# Altium schematic sheet Main.SchDoc
size A3; SheetNumber: 7; SheetTotal: 7
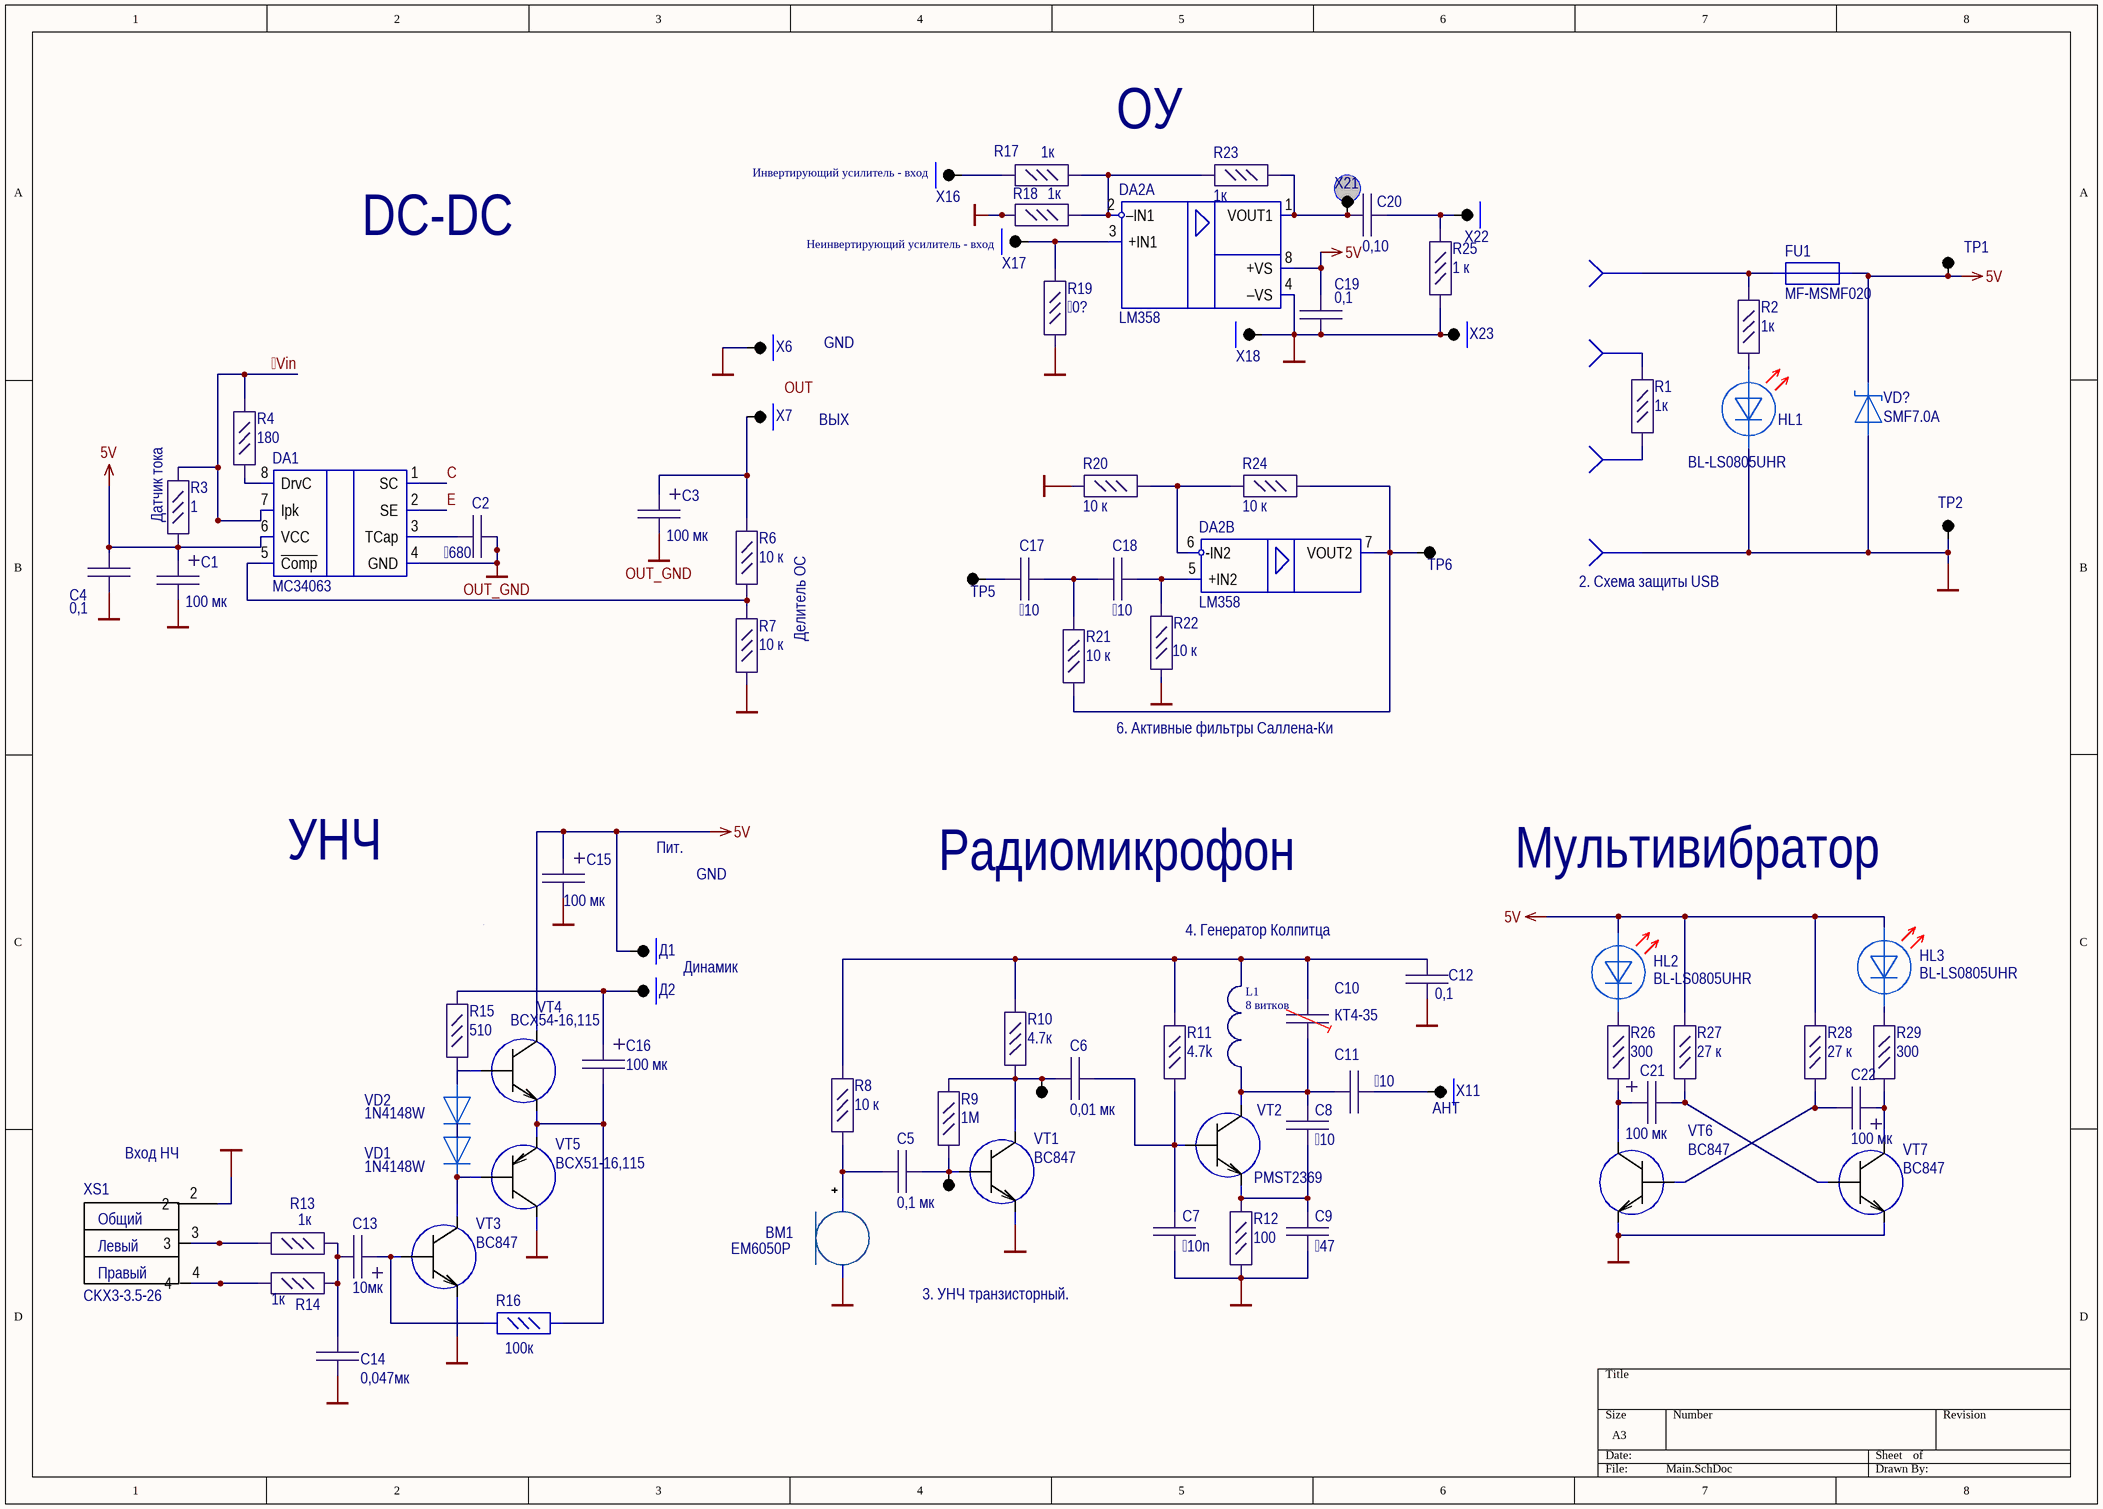
[diagram p0: Main.SchDoc]

## Parts
(Parts that share a designator on the sheet are numbered #1, #2 ... from top to bottom, then left to right.)
BM1  EM6050P  [EM6050P]
C1  100 мк  [SMD_al_cap_0605_6.3]
C2  680  [C_0805]
C3  100 мк  [SMD_al_cap_0605_6.3]
C4  0,1  [C_0805]
C5  0,1 мк  [C_0805]
C6  0,01 мк  [C_0805]
C7  10n  [C_0805]
C8  10  [C_0805]
C9  47  [C_0805]
C10  КТ4-35  [KТ4-35]
C11  10  [C_0805]
C12  0,1  [C_0805]
C13  10мк  [C_CASE]
C14  0,047мк  [C_0805]
C15  100 мк  [SMD_al_cap_0605_6.3]
C16  100 мк  [C_CASE]
C17  10  [C_0805]
C18  10  [C_0805]
C19  0,1  [C_0805]
C20  0,10  [C_0805]
C21  100 мк  [SMD_al_cap_0605_6.3]
C22  100 мк  [SMD_al_cap_0605_6.3]
DA1  MC34063  [SO-8]
DA2  LM358  [SO-8]  (parts A,B of 2)
FU1  MF-MSMF020  [FUSE 1812]
HL1  BL-LS0805UHR  [LED_0805_RED]
HL2  BL-LS0805UHR  [LED_0805_RED]
HL3  BL-LS0805UHR  [LED_0805_RED]
L1  8 витков  [Inductor]
R1  1к  [R_0805]
R2  1к  [R_0805]
R3  1  [R_0805]
R4  180  [R_0805]
R6  10 к  [R_0805]
R7  10 к  [R_0805]
R8  10 к  [R_0805]
R9  1М  [R_0805]
R10  4.7к  [R_0805]
R11  4.7k  [R_0805]
R12  100  [R_0805]
R13  1к  [R_0805]
R14  1к  [R_0805]
R15  510  [R_0805]
R16  100к  [R_0805]
R17  1к  [R_0805]
R18  1к  [R_0805]
R19  0?  [R_0805]
R20  10 к  [R_0805]
R21  10 к  [R_0805]
R22  10 к  [R_0805]
R23  1к  [R_0805]
R24  10 к  [R_0805]
R25  1 к  [R_0805]
R26  300  [R_0805]
R27  27 к  [R_0805]
R28  27 к  [R_0805]
R29  300  [R_0805]
TP1  Test_Point_1  [PLS-1]  (value not drawn)
TP2  Test_Point_1  [PLS-1]  (value not drawn)
TP5  Test_Point_1  [PLS-1]  (value not drawn)
TP6  Test_Point_1  [PLS-1]  (value not drawn)
TP?#1  Test_Point_1  [PLS-1]  (value not drawn)
TP?#2  Test_Point_1  [PLS-1]  (value not drawn)
VD1  1N4148W  [SOD-80]
VD2  1N4148W  [SOD-80]
VD?  SMF7.0A  [SOD-123F]
VT1  BC847  [SOT23]
VT2  PMST2369  [SOT-323]
VT3  BC847  [SOT23]
VT4  BCX54-16,115  [SOT89]
VT5  BCX51-16,115  [SOT89]
VT6  BC847  [SOT23]
VT7  BC847  [SOT23]
X6  КТ  [PLS-1]  (value not drawn)
X7  КТ  [PLS-1]  (value not drawn)
X11  КТ  [PLS-1]  (value not drawn)
X16  КТ  [PLS-1]  (value not drawn)
X17  КТ  [PLS-1]  (value not drawn)
X18  КТ  [PLS-1]  (value not drawn)
X21  КТ  [PLS-1]  (value not drawn)
X22  КТ  [PLS-1]  (value not drawn)
X23  КТ  [PLS-1]  (value not drawn)
X?#1  X  [KT_1]  (value not drawn)
X?#2  X  [KT_1]  (value not drawn)
X?#3  X  [KT_1]  (value not drawn)
X?#4  X  [KT_1]  (value not drawn)
XS1  CKX3-3.5-26  [CKX3-3.5-26]
Д1  КТ  [PLS-1]  (value not drawn)
Д2  КТ  [PLS-1]  (value not drawn)

## Nets
5V: C1.1 C4.1 C15.1 C19.1 DA1.6(VCC) DA2.8(+VS) FU1.2 HL2.1 HL3.1 R3.2 R27.1 R28.1 TP1.1 VD?.2 VT4.2(C) Д1.1
GND: BM1.2 C1.2 C4.2 C7.2 C9.2 C12.2 C14.1 C15.2 C19.2 DA2.4(–VS) HL1.2 R7.2 R12.2 R18.2 R19.2 R20.2 R22.2 R25.2 TP2.1 VD?.1 VT1.2(E) VT3.2(E) VT5.2(C) VT6.2(E) VT7.2(E) X6.1 X18.1 X23.1 X?#4.1 XS1.2
OUT_GND: C2.1 C3.2 DA1.4(GND)
Vin: DA1.7(Ipk) R3.1 R4.1
C: DA1.1(SC)
E: DA1.2(SE)
NetBM1_1: BM1.1 C5.1 R8.2
NetC2_2: C2.2 DA1.3(TCap)
NetC3_1: C3.1 R6.1 X7.1
NetC5_2: C5.2 R9.2 TP?#2.1 VT1.1(B)
NetC6_1: C6.1 R9.1 R10.2 TP?#1.1 VT1.3(C)
NetC6_2: C6.2 C7.1 R11.2 VT2.1(B)
NetC8_1: C8.1 C10.2 C11.2 L1.1 VT2.3(C)
NetC8_2: C8.2 C9.1 R12.1 VT2.2(E)
NetC10_1: C10.1 C12.1 L1.2 R8.1 R10.1 R11.1
NetC11_1: C11.1 X11.1
NetC13_1: C13.1 R16.2 VT3.1(B)
NetC13_2: C13.2 C14.2 R13.2 R14.2
NetC16_1: C16.1 R15.2 Д2.1
NetC16_2: C16.2 R16.1 VT4.3(E) VT5.3(E)
NetC17_1: C17.1 TP5.1
NetC17_2: C17.2 C18.1 R21.1
NetC18_2: C18.2 DA2.5(+IN2) R22.1
NetC20_1: C20.1 DA2.1(VOUT1) R23.1 X21.1
NetC20_2: C20.2 R25.1 X22.1
NetC21_1: C21.1 R26.2 VT6.3(C)
NetC21_2: C21.2 R27.2 VT7.1(B)
NetC22_1: C22.1 R29.2 VT7.3(C)
NetC22_2: C22.2 R28.2 VT6.1(B)
NetDA1_5: DA1.5(~{Comp}) R6.2 R7.1
NetDA1_8: DA1.8(DrvC) R4.2
NetDA2_2: DA2.2(–IN1) R17.1 R18.1 R23.2
NetDA2_3: DA2.3(+IN1) R19.1 X17.1
NetDA2_6: DA2.6(-IN2) R20.1 R24.2
NetDA2_7: DA2.7(VOUT2) R21.2 R24.1 TP6.1
NetFU1_1: FU1.1 R2.1 X?#1.1
NetHL1_1: HL1.1 R2.2
NetHL2_2: HL2.2 R26.1
NetHL3_2: HL3.2 R29.1
NetR1_1: R1.1 X?#2.1
NetR1_2: R1.2 X?#3.1
NetR13_1: R13.1 XS1.3
NetR14_1: R14.1 XS1.4
NetR15_1: R15.1 VD2.1 VT4.1(B)
NetR17_2: R17.2 X16.1
NetVD1_1: VD1.1 VD2.2
NetVD1_2: VD1.2 VT3.3(C) VT5.1(B)

## Notes on the sheet
- (near X16) Инвертирующий усилитель - вход
- ОУ
- DC-DC
- (near X17) Неинвертирующий усилитель - вход
- GND
- (near R3) Датчик тока
- ВЫХ
- Делитель ОС
- (near X?#4) 2. Схема защиты USB
- 6. Активные фильтры Саллена-Ки
- Пит.
- УНЧ
- Радиомикрофон
- Мультивибратор
- Динамик
- (near L1) 4. Генератор Колпитца
- (near X11) АНТ
- (near XS1) Вход НЧ
- 3. УНЧ транзисторный.
- Labels drawn without touching a wire or pin: OUT
- (in symbol CKX3-3.5-26) Общий; Левый; Правый

## Library data of the parts
C1 C3 C13 C15 C16 C21 C22 = TAJB107K004RNJ: CAP TANT 100UF 10% 4V 1411; Manufacturer: AVX Corporation; Value: 100µF; Part Number: TAJB107K004RNJ; ComponentLink1URL: http://datasheets.avx.com/TAJ.pdf; ComponentLink1Description: Datasheet; Component Type: Tantalum Capacitor
C2 C4-C9 C11 C12 C17-C20 = GRM188R72A104KA35D: CAP CER 0.1UF 100V X7R 0603; Manufacturer: Murata Electronics; Value: 0.1µF; Part Number: GRM188R72A104KA35D; ComponentLink1URL: https://www.murata.com/~/media/webrenewal/support/library/catalog/products/capacitor/mlcc/c02e.ashx?la=en-us; ComponentLink1Description: Datasheet; Component Type: Capasitor
C14 = GRM188R72A104KA35D: Manufacturer: Murata Electronics; Value: 0.1µF; Part Number: GRM188R72A104KA35D; ComponentLink1URL: https://www.murata.com/~/media/webrenewal/support/library/catalog/products/capacitor/mlcc/c02e.ashx?la=en-us; ComponentLink1Description: Datasheet; Component Type: Capasitor
L1 = Inductor
R1-R4 R9-R14 R17-R19 R23 R25-R29 = CR0603-FX-1002ELF: RES SMD 10K OHM 1% 1/10W 0603; Manufacturer: Bourns Inc.; Value: 10 к; Part Number: CR0603-FX-1002ELF; ComponentLink1URL: https://www.bourns.com/pdfs/chpreztr.pdf; ComponentLink1Description: Datasheet; Component Type: Resistor
R6-R8 R20-R22 R24 = CR0603-FX-1002ELF: RES SMD 10K OHM 1% 1/10W 0603; Manufacturer: Bourns Inc.; Part Number: CR0603-FX-1002ELF; Value: 10 к; ComponentLink1URL: https://www.bourns.com/pdfs/chpreztr.pdf; ComponentLink1Description: Datasheet; Component Type: Resistor
R15 = CR0603-FX-1002ELF: Manufacturer: Bourns Inc.; Value: 10 к; Part Number: CR0603-FX-1002ELF; ComponentLink1URL: https://www.bourns.com/pdfs/chpreztr.pdf; ComponentLink1Description: Datasheet; Component Type: Resistor
R16 = R_C1-4
VD1 VD2 = LL4148-GS08: Диод
VD? = SMAJ5.0A-TR: Защитный диод, однонаправленный
VT2 = BC847
VT5 = BCX51-16,115_1
X?#1-X?#4 = X: Контактная площадка